# Altium schematic sheet FFD.SchDoc
size A4
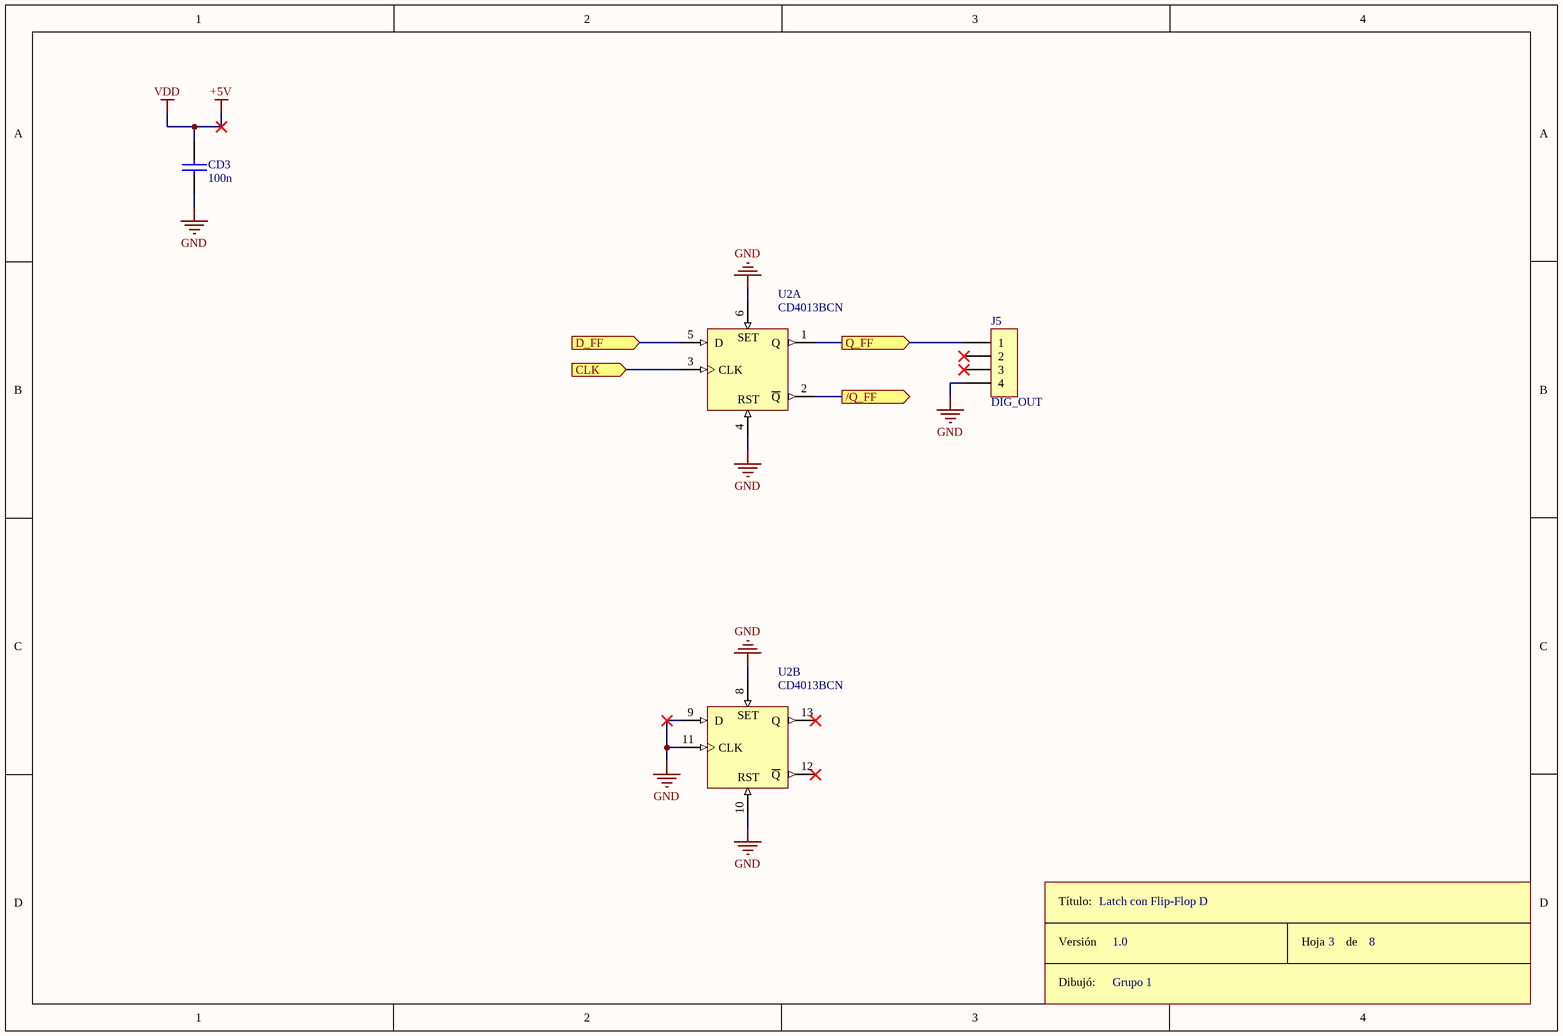
[diagram p0: FFD.SchDoc]

## Parts
CD3  100n  [CAP100]
J5  DIG_OUT  [SIP4]
ROT2  Rótulo  (value not drawn)
U2  CD4013BCN  [N14A]  (parts A,B of 2)

## Ports
/Q_FF (out), CLK (in), D_FF (in), Q_FF (out)

## Nets
+5V: CD3.1 U2.14(VDD)  [also labelled VDD]
GND: CD3.2 J5.4 U2.4(RST) U2.6(S) U2.7(GND) U2.8(S) U2.9(D) U2.10(RST) U2.11(CLK)
/Q_FF: U2.2(~{Q}) ; port /Q_FF
CLK: U2.3(CLK) ; port CLK
D_FF: U2.5(D) ; port D_FF
Q_FF: J5.1 U2.1(Q) ; port Q_FF

Not connected (* = marked no-connect by the designer): J5 2* 3*; U2 12(~{Q})* 13(Q)*

## Notes on the sheet
- Latch con Flip-Flop D
- 1.0
- Grupo 1
- 3
- 8
- (in symbol CD4013BCN, part A) SET
- (in symbol CD4013BCN, part B) SET
- (in symbol Rótulo) Título:; Versión; Hoja       de; Dibujó:

## Library data of the parts
CD3 = CAP
J5 = CON4
U2 = CD4013BCN: Dual D-Type Flip-Flop; Published: 17-Jul-2002; LatestRevisionDate: 29-May-2009; LatestRevisionNote: Component Body Added.; DatasheetVersion: Jan-1999; PackageVersion: 2000; PackageReference: N14A; Publisher: Altium Limited; PackageDescription: DIP, 14-Pin, Row Spacing 7.62 mm, Pitch 2.54 mm; ComponentLink1Description: Manufacturer Link; ComponentLink1URL: http://www.fairchildsemi.com/